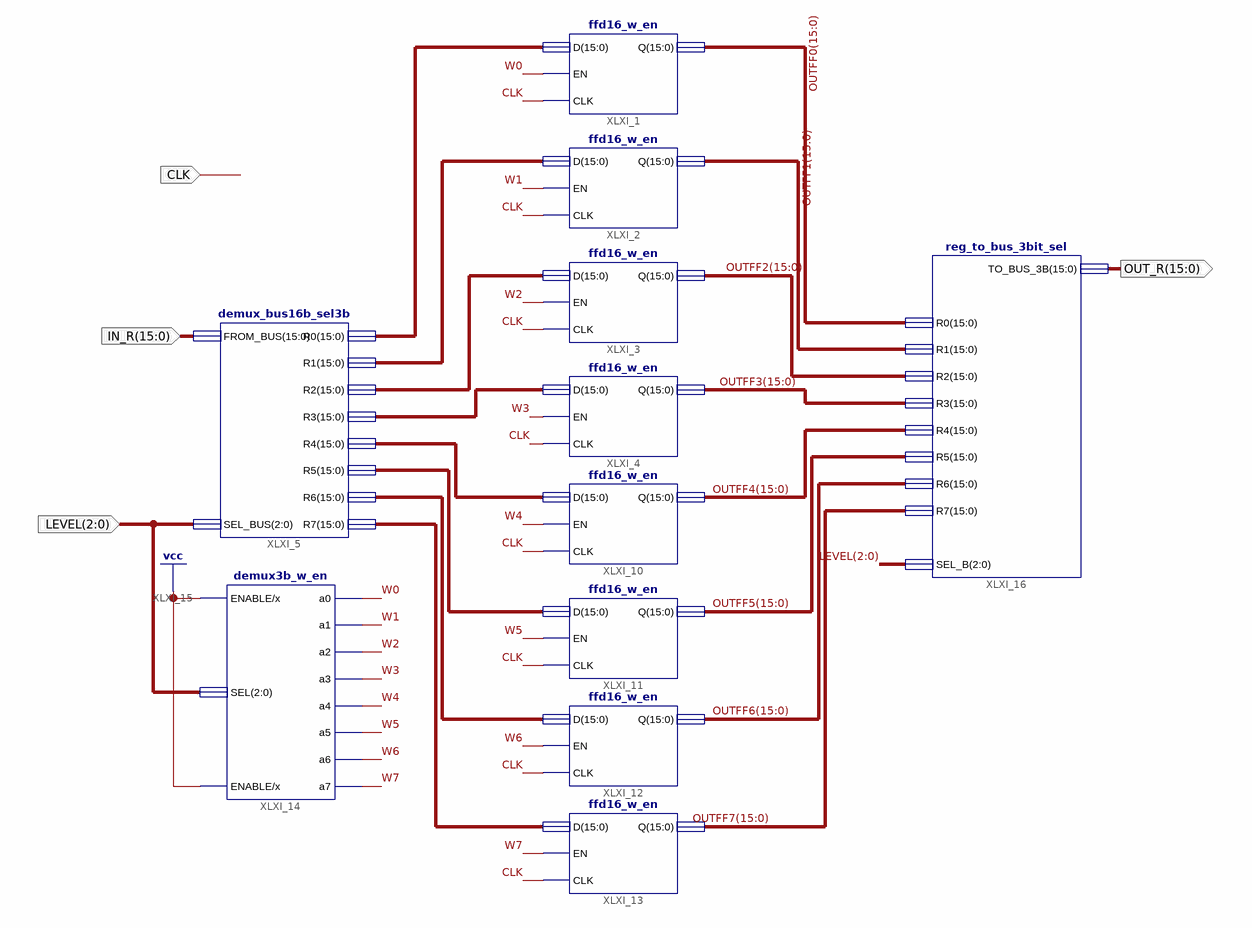
[diagram p0: schematic sheet 1]
// Xilinx ISE schematic jsr_backup_reg.sch (artix7) as structural Verilog: 11 symbols, 4 ports
module jsr_backup_reg (
  input  [2:0] LEVEL,
  input  [15:0] IN_R,
  input  CLK,
  output [15:0] OUT_R
);

  wire W0, W1, W2, W3, W4, W5, W6, W7;
  wire [15:0] OUTFF0, OUTFF1, OUTFF2, OUTFF3, OUTFF4, OUTFF5, OUTFF6, OUTFF7, XLXN_3, XLXN_4, XLXN_5, XLXN_6,
       XLXN_7, XLXN_8, XLXN_9, XLXN_10;

  demux_bus16b_sel3b XLXI_5 (
    .FROM_BUS(IN_R), .SEL_BUS(LEVEL), .R0(XLXN_3), .R1(XLXN_4), .R2(XLXN_5), .R3(XLXN_6), .R4(XLXN_7),
    .R5(XLXN_8), .R6(XLXN_9), .R7(XLXN_10));
  ffd16_w_en XLXI_1 (.D(XLXN_3), .EN(W0), .CLK(CLK), .Q(OUTFF0));
  ffd16_w_en XLXI_2 (.D(XLXN_4), .EN(W1), .CLK(CLK), .Q(OUTFF1));
  ffd16_w_en XLXI_3 (.D(XLXN_5), .EN(W2), .CLK(CLK), .Q(OUTFF2));
  ffd16_w_en XLXI_4 (.D(XLXN_6), .EN(W3), .CLK(CLK), .Q(OUTFF3));
  ffd16_w_en XLXI_10 (.D(XLXN_7), .EN(W4), .CLK(CLK), .Q(OUTFF4));
  ffd16_w_en XLXI_11 (.D(XLXN_8), .EN(W5), .CLK(CLK), .Q(OUTFF5));
  ffd16_w_en XLXI_12 (.D(XLXN_9), .EN(W6), .CLK(CLK), .Q(OUTFF6));
  ffd16_w_en XLXI_13 (.D(XLXN_10), .EN(W7), .CLK(CLK), .Q(OUTFF7));
  demux3b_w_en XLXI_14 (
    .ENABLE(1'b1), .SEL(LEVEL), .x(1'b1), .a0(W0), .a1(W1), .a2(W2), .a3(W3), .a4(W4), .a5(W5), .a6(W6),
    .a7(W7));
  reg_to_bus_3bit_sel XLXI_16 (
    .R0(OUTFF0), .R1(OUTFF1), .R2(OUTFF2), .R3(OUTFF3), .R4(OUTFF4), .R5(OUTFF5), .R6(OUTFF6), .R7(OUTFF7),
    .TO_BUS_3B(OUT_R), .SEL_B(LEVEL));
endmodule
